# EAGLE design XBee_nRF53240_1_2_may_2022 (EAGLE 9.6.2)
COMPANY: JKSOFT Educational; REV: 1.1; TITLE: RPBee nRF52

## Sheet 1 of 2
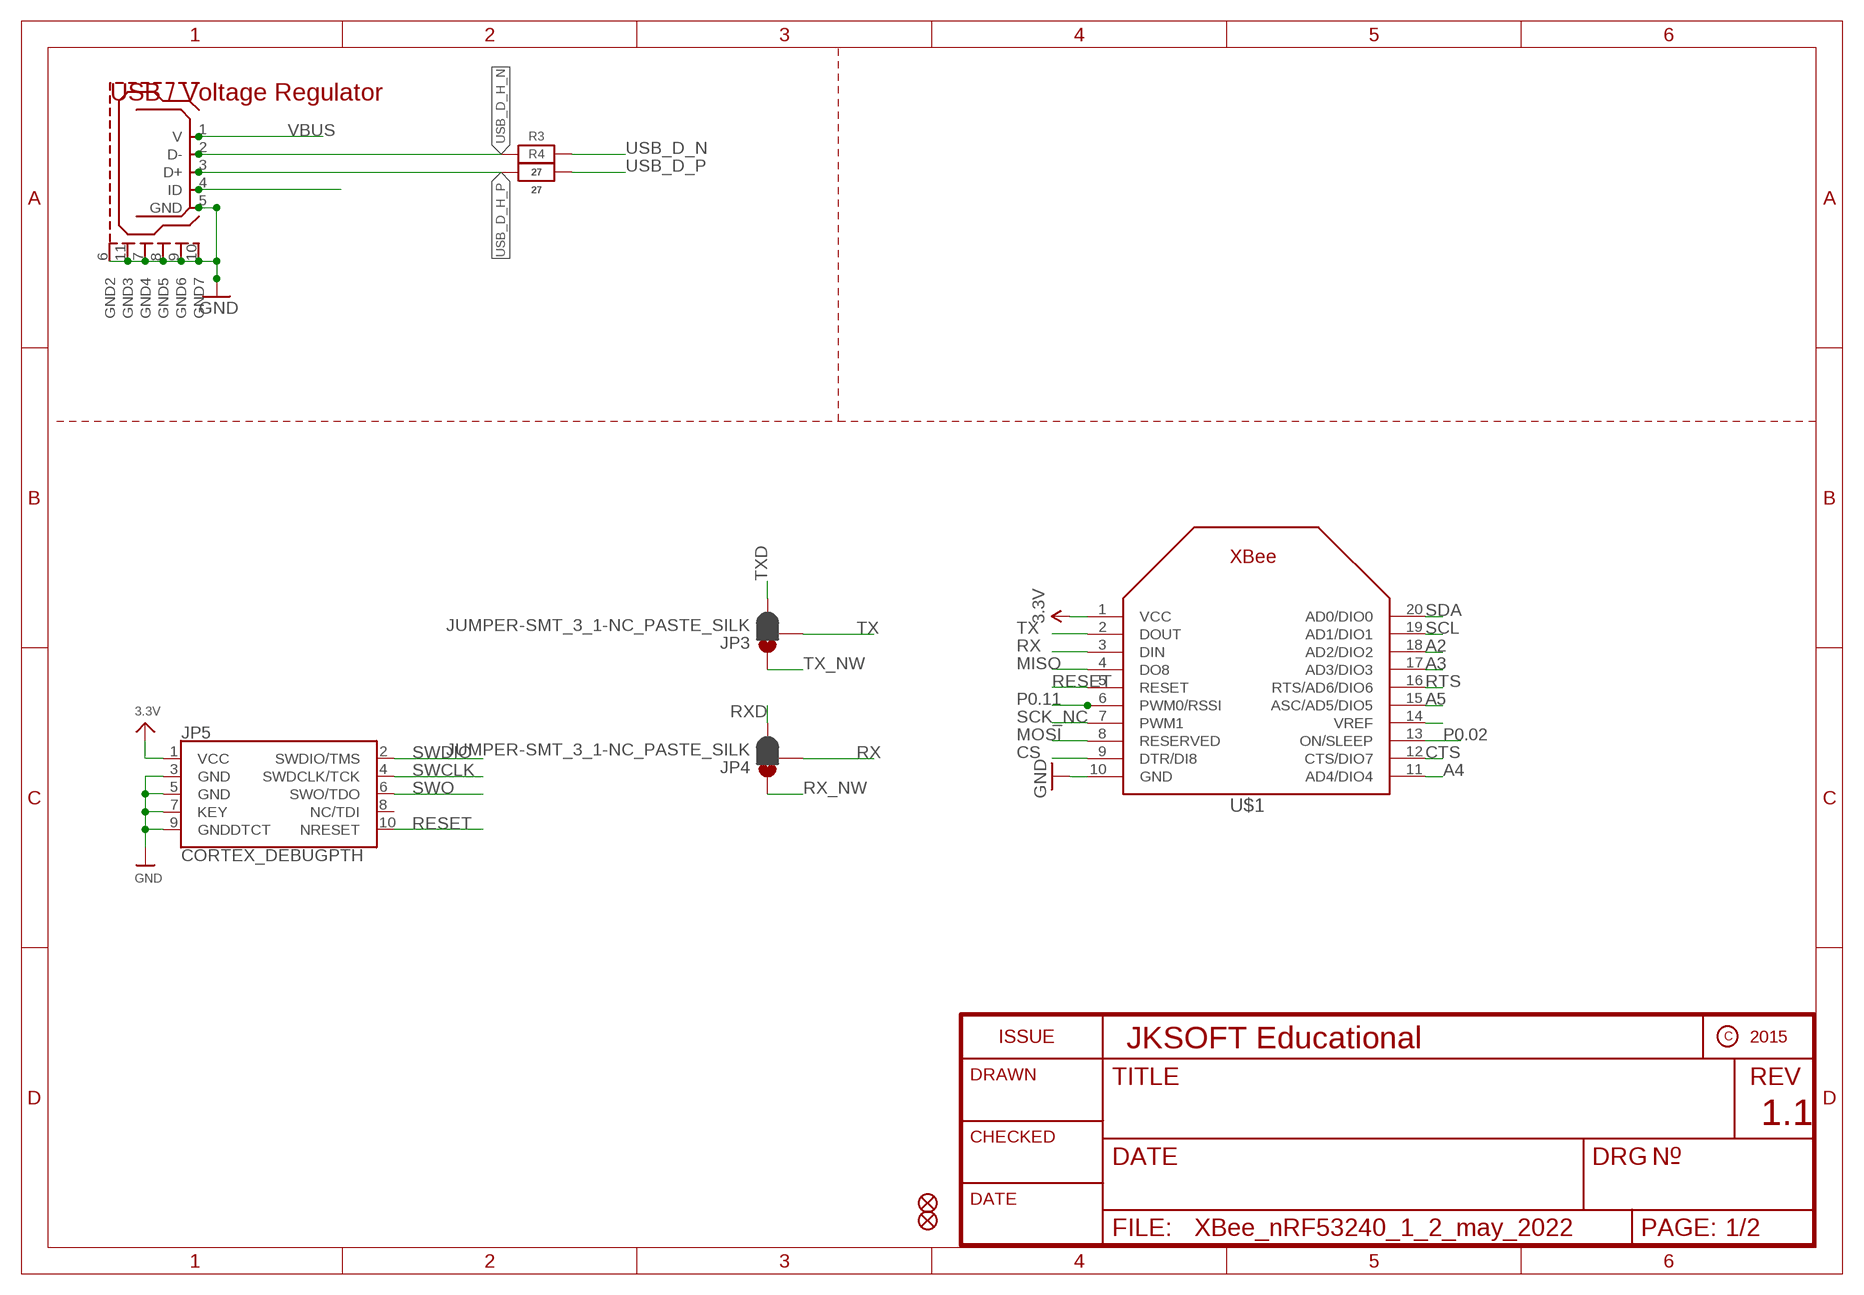
[diagram p0: schematic, sheet 1]

### Parts
FID1  FIDUCIAL_1MM  [FIDUCIAL_1MM]
FID3  FIDUCIAL_1MM  [FIDUCIAL_1MM]
JP3  JUMPER-SMT_3_1-NC_PASTE_SILK  [SMT-JUMPER_3_1-NC_PASTE_SILK]
JP4  JUMPER-SMT_3_1-NC_PASTE_SILK  [SMT-JUMPER_3_1-NC_PASTE_SILK]
JP5  CORTEX_DEBUGPTH  [2X5-PTH-1.27MM]
R3  27  RESISTOR_0603_NOOUT  [0603-NO]
R4  27  RESISTOR_0603_NOOUT  [0603-NO]
U$1  XBEE  [XBEE]
U$2  USB_MICROB  [USB_MICROB_PACKAGE]

### Nets
3.3V [power]: JP5.1(VCC) U$1.1(VCC) ; also sheet 2
A2: U$1.18(AD2/DIO2)
A3: U$1.17(AD3/DIO3)
A4: U$1.11(AD4/DIO4)
A5: U$1.15(ASC/AD5/DIO5)
CS: U$1.9(DTR/DI8)
CTS: U$1.12(CTS/DIO7) ; also sheet 2
GND: JP5.3(GND) JP5.5(GND) JP5.7(KEY) JP5.9(GNDDTCT) U$1.10(GND) U$2.5(GND) U$2.6(GND2) U$2.7(GND4) U$2.8(GND5) U$2.9(GND6) U$2.10(GND7) U$2.11(GND3) ; also sheet 2
MISO: U$1.4(DO8)
MOSI: U$1.8(RESERVED)
N$2: U$1.14(VREF)
N$4: U$2.4(ID)
P0.02: U$1.13(ON/SLEEP)
P0.11: U$1.6(PWM0/RSSI)
RESET: JP5.10(NRESET) U$1.5(RESET) ; also sheet 2
RTS: U$1.16(RTS/AD6/DIO6) ; also sheet 2
RX: JP4.2 U$1.3(DIN)
RX_NW: JP4.1 ; also sheet 2
RXD: JP4.3 ; also sheet 2
SCK_NC: U$1.7(PWM1)
SCL: U$1.19(AD1/DIO1) ; also sheet 2
SDA: U$1.20(AD0/DIO0) ; also sheet 2
SWCLK: JP5.4(SWDCLK/TCK) ; also sheet 2
SWDIO: JP5.2(SWDIO/TMS) ; also sheet 2
SWO: JP5.6(SWO/TDO)
TX: JP3.2 U$1.2(DOUT)
TX_NW: JP3.1 ; also sheet 2
TXD: JP3.3 ; also sheet 2
USB_D_H_N: R3.1 U$2.2(D-)
USB_D_H_P: R4.1 U$2.3(D+)
USB_D_N: R3.2 ; also sheet 2
USB_D_P: R4.2 ; also sheet 2
VBUS: U$2.1(V) ; also sheet 2
Unconnected: JP5.8(NC/TDI)

### Notes on the sheet
- USB / Voltage Regulator

## Sheet 2 of 2
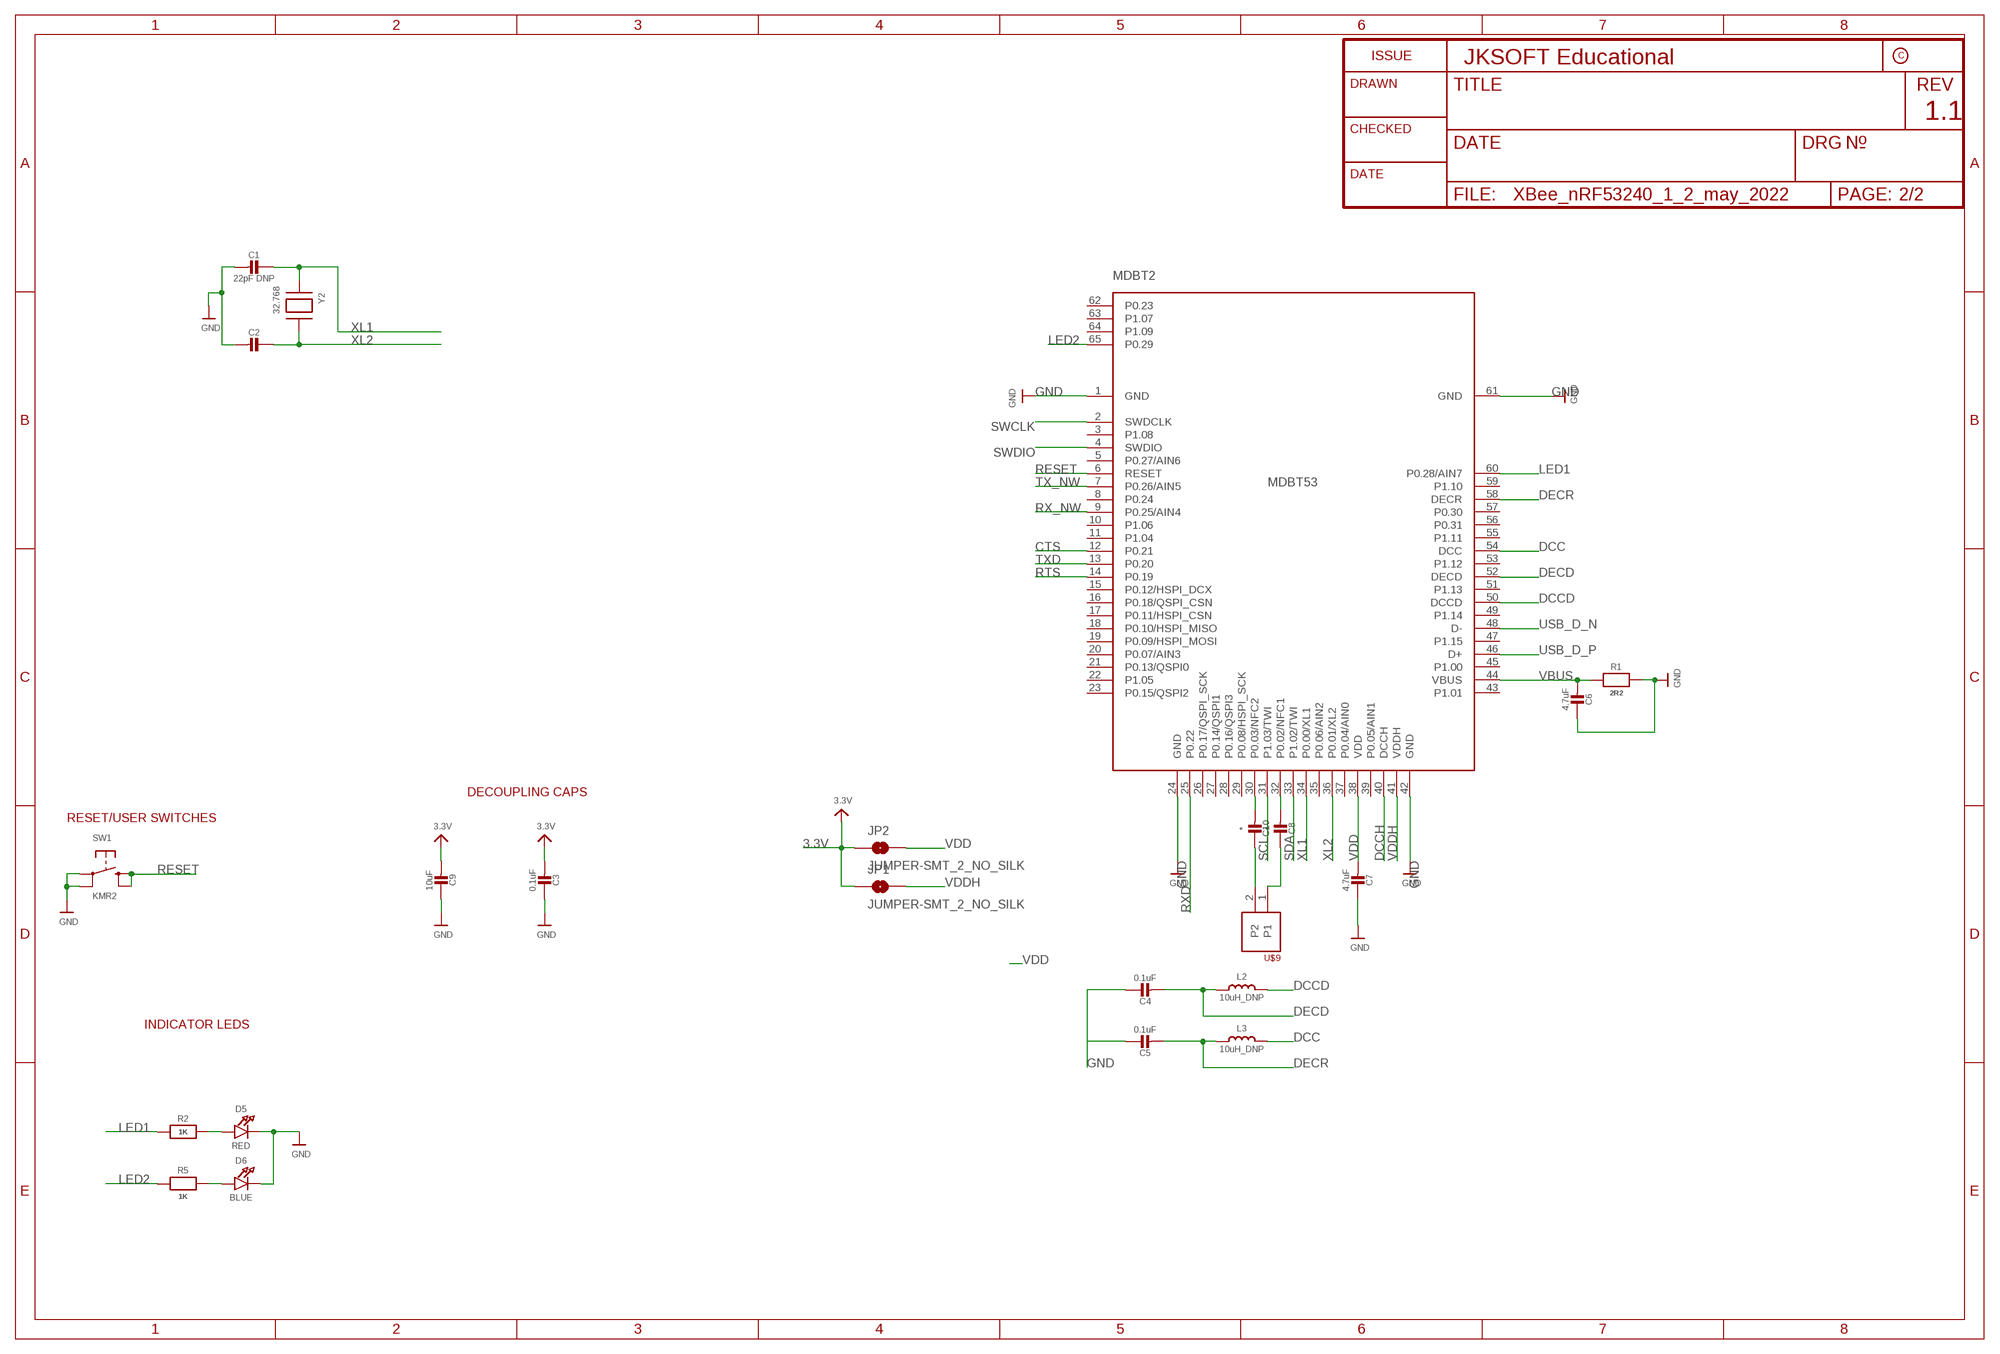
[diagram p1: schematic, sheet 2]

### Parts
C1  22pF DNP  CAP_CERAMIC0603_NO  [0603-NO]
C2  22pF DNP  CAP_CERAMIC0603_NO  [0603-NO]
C3  0.1uF  CAP_CERAMIC0603_NO  [0603-NO]
C4  0.1uF  CAP_CERAMIC0603_NO  [0603-NO]
C5  0.1uF  CAP_CERAMIC0603_NO  [0603-NO]
C6  4.7uF  CAP_CERAMIC0805-NOOUTLINE  [0805-NO]
C7  4.7uF  CAP_CERAMIC0805-NOOUTLINE  [0805-NO]
C8  *  CAP_CERAMIC0603_NO  [0603-NO]
C9  10uF  CAP_CERAMIC0805-NOOUTLINE  [0805-NO]
C10  *  CAP_CERAMIC0603_NO  [0603-NO]
D5  RED  LED0805_NOOUTLINE  [CHIPLED_0805_NOOUTLINE]
D6  BLUE  LED0805_NOOUTLINE  [CHIPLED_0805_NOOUTLINE]
JP1  JUMPER-SMT_2_NO_SILK  [SMT-JUMPER_2_NO_SILK]
JP2  JUMPER-SMT_2_NO_SILK  [SMT-JUMPER_2_NO_SILK]
L2  10uH_DNP  INDUCTOR_0805MP  [_0805MP]
L3  10uH_DNP  INDUCTOR_0805MP  [_0805MP]
MDBT2  MDBT53  [MDBT53]
R1  2R2  RESISTOR_0603_NOOUT  [0603-NO]
R2  1K  RESISTOR_0603_NOOUT  [0603-NO]
R5  1K  RESISTOR_0603_NOOUT  [0603-NO]
SW1  KMR2  SWITCH_TACT_SMT4.6X2.8  [BTN_KMR2_4.6X2.8]
U$9  PHOENIX_PTSM_M2_TH  [PTSM_M2_THRHOLE]
Y2  32.768  XTAL-3.2X1.5  [XTAL3215]

### Nets
3.3V [power]: C3.2 C9.2 JP1.1 JP2.1 ; also sheet 1
CTS: MDBT2.12(P0.21) ; also sheet 1
DCC: L3.2 MDBT2.54(DCC)
DCCD: L2.2 MDBT2.50(DCCD)
DCCH: MDBT2.40(DCCH)
DECD: C4.2 L2.1 MDBT2.52(DECD)
DECR: C5.2 L3.1 MDBT2.58(DECR)
GND: C1.2 C2.2 C3.1 C4.1 C6.1 C7.1 C9.1 D5.C D6.C MDBT2.1(GND) MDBT2.24(GND) MDBT2.42(GND) MDBT2.61(GND) R1.2 SW1.A'(P1) SW1.A(P) ; also sheet 1
LED1: MDBT2.60(P0.28/AIN7) R2.1
LED2: MDBT2.65(P0.29) R5.1
N$1: C10.2 MDBT2.30(P0.03/NFC2)
N$3: C5.1
N$5: C8.2 MDBT2.32(P0.02/NFC1)
N$6: C10.1 U$9.2
N$7: C8.1 U$9.1
N$8: D6.A R5.2
N$15: D5.A R2.2
RESET: MDBT2.6(RESET) SW1.B'(S1) SW1.B(S) ; also sheet 1
RTS: MDBT2.14(P0.19) ; also sheet 1
RX_NW: MDBT2.9(P0.25/AIN4) ; also sheet 1
RXD: MDBT2.25(P0.22) ; also sheet 1
SCL: MDBT2.31(P1.03/TWI) ; also sheet 1
SDA: MDBT2.33(P1.02/TWI) ; also sheet 1
SWCLK: MDBT2.2(SWDCLK) ; also sheet 1
SWDIO: MDBT2.4(SWDIO) ; also sheet 1
TX_NW: MDBT2.7(P0.26/AIN5) ; also sheet 1
TXD: MDBT2.13(P0.20) ; also sheet 1
USB_D_N: MDBT2.48(D-) ; also sheet 1
USB_D_P: MDBT2.46(D+) ; also sheet 1
VBUS: C6.2 MDBT2.44(VBUS) R1.1 ; also sheet 1
VDD: C7.2 JP2.2 MDBT2.38(VDD)
VDDH: JP1.2 MDBT2.41(VDDH)
XL1: C1.1 MDBT2.34(P0.00/XL1) Y2.P$1
XL2: C2.1 MDBT2.36(P0.01/XL2) Y2.P$2
Unconnected: MDBT2.3(P1.08) MDBT2.5(P0.27/AIN6) MDBT2.8(P0.24) MDBT2.10(P1.06) MDBT2.11(P1.04) MDBT2.15(P0.12/HSPI_DCX) MDBT2.16(P0.18/QSPI_CSN) MDBT2.17(P0.11/HSPI_CSN) MDBT2.18(P0.10/HSPI_MISO) MDBT2.19(P0.09/HSPI_MOSI) MDBT2.20(P0.07/AIN3) MDBT2.21(P0.13/QSPI0) MDBT2.22(P1.05) MDBT2.23(P0.15/QSPI2) MDBT2.26(P0.17/QSPI_SCK) MDBT2.27(P0.14/QSPI1) MDBT2.28(P0.16/QSPI3) MDBT2.29(P0.08/HSPI_SCK) MDBT2.35(P0.06/AIN2) MDBT2.37(P0.04/AIN0) MDBT2.39(P0.05/AIN1) MDBT2.43(P1.01) MDBT2.45(P1.00) MDBT2.47(P1.15) MDBT2.49(P1.14) MDBT2.51(P1.13) MDBT2.53(P1.12) MDBT2.55(P1.11) MDBT2.56(P0.31) MDBT2.57(P0.30) MDBT2.59(P1.10) MDBT2.62(P0.23) MDBT2.63(P1.07) MDBT2.64(P1.09)

### Notes on the sheet
- DECOUPLING CAPS
- RESET/USER SWITCHES
- INDICATOR LEDS

## Library data of the parts
C1-C10 = microbuilder:CAP_CERAMIC: Ceramic Capacitors For new designs, use the packages preceded by an '_' character since they are more reliable: The following footprints should be used on most boards: _0402 - Standard footprint for regular board layouts _0603 - Standard footprint for regular board layouts _0805 - Standard footprint for regular board layouts _1206 - Standard footprint for regular board layouts For extremely tight-pitch boards where space is at a premium, the following 'micro-pitch' footprints can be used (smaller pads, no silkscreen outline, etc.): _0402MP - Micro-pitch footprint for very dense/compact boards _0603MP - Micro-pitch footprint for very dense/compact boards _0805MP - Micro-pitch footprint for very dense/compact boards _1206MP - Micro-pitch footprint for very dense/compact boards
D5 D6 = microbuilder:LED: LED 0603 - 0603 Surface Mount Package 2mA: Green LED - Low Power (3.9mcd, 2ma, 1.7Vf) - Digikey: 475-2709-2-ND Orange LED - Low Power (9.8mcd, 2ma, 1.8Vf) - Digikey: 475-1194-2-ND Red LED - Low Power (5mcd, 2ma, 1.8Vf) - Digikey: 475-1195-2-ND Yellow LED - Low Power (7mcd, 2ma, 1.8Vf) - Digikey: 475-1196-2-ND 5mA: Blue LED - Low Power (17mcd, 5ma, 2.9Vf) - Digikey: LNJ937W8CRACT-ND 0805 - 0805 Surface Mount Package 2mA: Red LED (8.8mcd, 2mA, 1.8Vf, Clear) - Low Power [Digikey: 475-2510-1-ND] Green LED (5mcd, 2mA, 1.8Vf, Clear) - Low Power [Digikey: 475-2730-1-ND] Yellow LED (11.3mcd, 2mA, 1.8Vf, Clear) - Low Power [Digikey: 475-2555-1-ND] 20mA: Red LED (104mcd, 20mA, Diffused) - LS R976 [Digikey: 475-1278-6-ND] Red LED (12mcd, 20mA, 2.0Vf, Clear) - APT2012EC [Digikey: 754-1128-1-ND] Green LED (15mcd, 20mA, 2.2Vf, Clear) - APT2012GC [Digikey: 754-1131-1-ND] Orange LED (160mcd, 20mA, 2.1Vf, Clear) - APT2012SECK [Digikey: 754-1130-1-ND] 1206 - 1206 Surface Mount Package Green LED (26mcd, 20mA, Diffused) - LG N971 [Digikey: 475-1407-6-ND] Red LED (15mcd, 20mA, Diffused) - LH N974 [Digikey: 475-1416-6-ND] Cree - Cree High-Power Surface Mount LEDs XPEBWT-L1-0000-00D50 - White 111lm 350mA 2.9Vf 6200K 110° XTEAWT-00-0000-00000LEE3 - White 114lm 350mA 2.85Vf 5000K 115° Everlight - Everlight 45-21 Series Surface Mount LEDs 45-21/QK2C-B2832AC2CB2/2T - Warm White 2000mcd 20mA 3.25Vf 3050K 120° 45-21/LK2C-B38452C4CB2/2T - Nuetral White 2000mcd 20mA 3.25Vf 4150K 120° 45-21/LK2C-B50634C6CB2/2T - Cold White 2200mcd 20mA 3.25Vf 5650K 120° PLCC2 Reverse Mount LS T77K-J1L2-1-0-2-R18-Z - Red 11.25mcd 2mA 1.8Vf 630nm 120° LO T77K-L1M2-24-Z - Orange 19.6mcd 2mA 1.8Vf 606nm 120° LY T77K-K2M1-26-Z - Yellow 15.7mcd 2mA 1.8Vf 587nm 120°
FID1 FID3 = microbuilder:FIDUCIAL: Fiducial Alignment Points Various fiducial points for machine vision alignment.; BOM: EXCLUDE
JP1 JP2 = SparkFun-Jumpers:JUMPER-SMT_2_NO: Normally open jumper This jumper has two pads in close proximity to each other. Apply solder to close the connection. Round pads are easier to solder for beginners, but are a lot larger. SparkFun Product that uses the round pads: SparkFun EL Sequencer <https://www.sparkfun.com/products/12781>
JP3 JP4 = SparkFun-Jumpers:JUMPER-SMT_3_1-NC_PASTE: Normally closed solder jumper (1 of 2 connections) This jumper has an aperture in the stencil to allow solder paste to bridge one of the two connections. One connection is normally closed (NC), while the other is normally open (NO). Wick off the solder to open the connection. Reapply solder to reclose the connection. Apply solder to the other side instead to change the current path.
JP5 = samd21-temp:CORTEX_DEBUG: Cortex Debug Connector Datasheet <http://infocenter.arm.com/help/topic/com.arm.doc.faqs/attached/13634/cortex_debug_connectors.pdf>
L2 L3 = microbuilder:INDUCTOR: Inductors 0603: 10nH Ceramic Inductor - microwire antenna/RF (Digikey: 712-1434-2-ND) 0805: 560nH Ceramic Inductor - RF (Digikey: 553-1047-1-ND) 270nH Ceramic Inductor - Q = 40@250MHz, +-5%, 1 Ohm DC Resistance (Digikey: 535-10506-2-ND) 1007 (2518 Metric) SMT: 10µH 10% 250mOhm 820mA 1007 Inductor (Digikey: 587-2189-1-ND) 22µH 10% 500mOhm 580mA 1007 Inductor (Digikey: 587-2190-1-ND) 47µH 10% 950mOhm 420mA 1007 Inductor (Digikey: 587-2191-1-ND) 47µH 5% 100mOhm 1A 1008 Inductor (Digikey: 732-1816-1-ND) 5.0x5.0mm (Taiyo Yuden NR5040 Series) 6.8µH 20% 2.3A 64mOhm Inductor (Digikey: 587-2374-2-ND) 5.0x5.0mm (TDK VLC5045 Series) 4.7µH 20% 3.3A 34mOhm Inductor (Digikey: 445-6526-1-ND) 6.8µH 20% 2.7A 46mOhm Inductor (Digikey: 445-6527-1-ND) 6.0x6.0mm (TDK VLC6045 Series) 4.7µH 20% 3.8A 27mOhm Inductor (Digikey: 445-6538-2-ND) 6.8µH 20% 3A 41mOhm Inductor (Digikey: 445-6540-1-ND) 6.2µH 30% 2.2A 45mOhm Inductor (Digikey: SRR5028-6R2YCT-ND) - Not TDK VLC6045 but footprint should match 6.0x6.0mm (TDK SLF6045 Series) 6.8uH 30% 2A 33mOhm Inductor (Digikey: 445-4572-1-ND, Mouser: 810-SLF645T6R8N2R0PF) 6.0x6.0mm (Sumida CDRH5D28 Series) 6.2uH 30% 1.8A 45mOhm Inductor (Digikey: 308-1542-1-ND) Taiyo Yuden NR3015T2R2M - 2.2uH 20% 1.5A (Digikey: 587-1648-2-ND, Mouser: 963-NR3015T2R2M) - Used with TI TPS62172 CoilCraft RFID Transponder Coil - MA5532-AE (For use with AS3935 Lightning Sensor) Taiyo Yuden NRH2412T2R2MNGH - 2.2uH 20% 1AA (Digikey: 587-3443-1-ND) - Used with TI LM3671 Vishay IHLP 1.0uH Molded Inductor - 24mOhm DCR, 5A, +/-20%, -55°C-125°C (Digikey: 541-1319-1-ND)
MDBT2 = MDBT53_210707:MDBT53: Raytac Corporation Part Number: MDBT53-1M / MDBT53-P1M / MDBT53-U1M Bluetooth Low Energy Module based on Noridc nRF5340 Size: 14.3x9.3mm Source: Raytac datasheet
R1-R5 = microbuilder:RESISTOR: Resistors For new designs, use the packages preceded by an '_' character since they are more reliable: The following footprints should be used on most boards: _0402 - Standard footprint for regular board layouts _0603 - Standard footprint for regular board layouts _0805 - Standard footprint for regular board layouts _1206 - Standard footprint for regular board layouts For extremely tight-pitch boards where space is at a premium, the following 'micro-pitch' footprints can be used (smaller pads, no silkscreen outline, etc.): _0402MP - Micro-pitch footprint for very dense/compact boards _0603MP - Micro-pitch footprint for very dense/compact boards _0805MP - Micro-pitch footprint for very dense/compact boards _1206MP - Micro-pitch footprint for very dense/compact boards
SW1 = microbuilder:SWITCH_TACT_SMT: SMT Tact Switches 6x6mm - Digikey: P12940SCT-ND KMR2 (4.6x2.8mm) - Digikey: 401-1426-1-ND EVQ-PQHB55 - Light Touch, 160GF (4.5x4.5mm) - Digikey: P8090SCT-ND KMT0 - KMT021 NGJ LHS (etc.) IP68/Waterproof - Digikey: CKN10289CT-ND
U$1 = adafruit:XBEE
U$2 = femtoduino:USB_MICROB: This is the hirose ZX62-B-5PA(11) MICRO-USB B Type female connection.
U$9 = jk_customs:PHOENIX_PTSM_M2_TH
Y2 = adafruit2:XTAL: Low cost SMT crystals, no capacitors included http://www.ladyada.net/library/eagle

## Net classes
1 power: width 0.254 mm

## Board
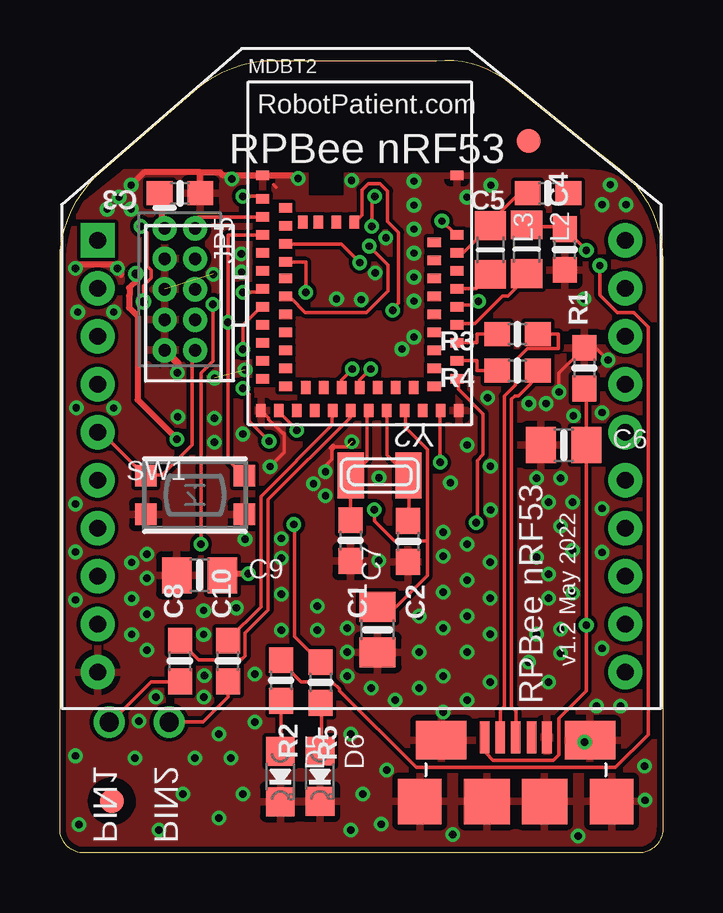
[diagram p2: board, top side]
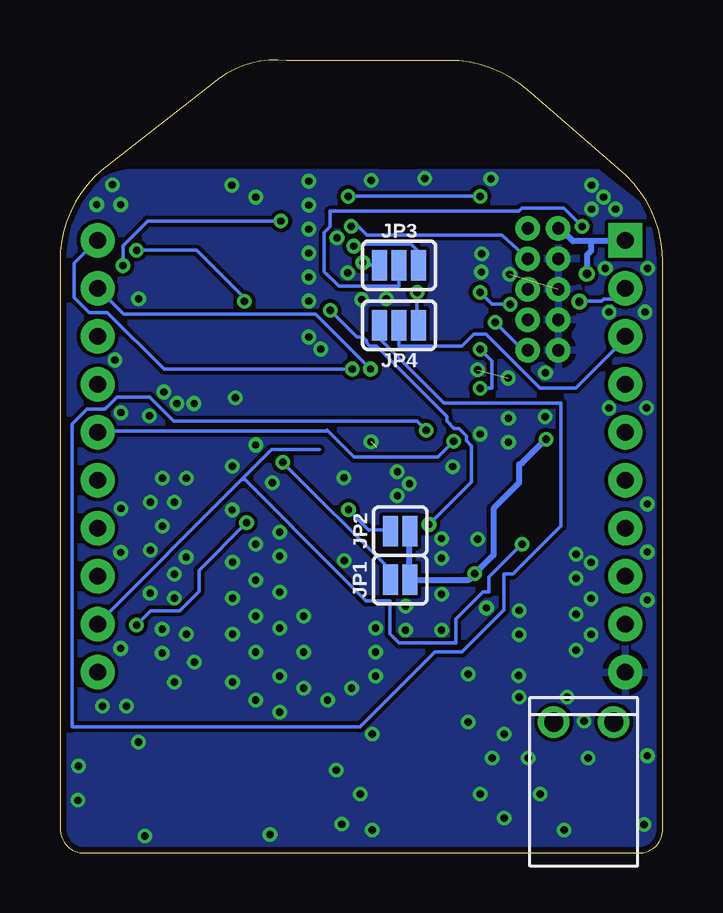
[diagram p3: board, bottom side, seen from below]

Size 25.14 x 33.06 mm. Coordinates in mm from the lower left corner, seen from the top.
Outline: 1.85,28.53 5.65,31.82 arc-41 8.93,33.04 15.69,33.04 arc-41 18.47,32.31 23.42,28.45 arc-49 25.14,24.67 25.14,7.09 25.13,1 arc-90 24.13,0 1,0 arc-90 0,1 0,24.64 arc-51 1.85,28.53
Copper layers (1*16): Top 0.035mm / dielectric 1.5mm / Bottom 0.035mm
Design rules "SeeedStudio_2layer_DRU_no_angle_20140221": minimum track width 6mil, minimum drill 12mil, track to track 6mil, track to pad 6mil, pad to pad 6mil, via to via 6mil, smd to smd 0mil, copper to edge 10mil, drill to drill 10mil, minimum pad ring 10mil, minimum via ring 6mil, stop-mask expansion 2mil, vias tented up to drill 100mil, thermal gap 10mil

### Footprints (pad centres in the part's own frame; a part is rotated, then mirrored left to right if it is on the bottom)
0603-NO = smd 1.075 x 1: 1 -0.85,0; 2 0.85,0
0805-NO = smd 1.24 x 1.5: 1 -0.95,0; 2 0.95,0
CHIPLED_0805_NOOUTLINE = smd 1.2 x 1.2: A 0,-1.05; C 0,1.05
FIDUCIAL_1MM = smd 1 x 1: 1 0,0
SMT-JUMPER_2_NO_SILK = smd 0.635 x 1.27: 1 -0.406,0; 2 0.406,0
SMT-JUMPER_3_1-NC_PASTE_SILK = smd 0.635 x 1.27: 1 -0.813,0; 2 0,0; 3 0.813,0
2X5-PTH-1.27MM = drill 0.508 pad 1: 1 -2.54,-0.635; 2 -2.54,0.635; 3 -1.27,-0.635; 4 -1.27,0.635; 5 0,-0.635; 6 0,0.635; 7 1.27,-0.635; 8 1.27,0.635; 9 2.54,-0.635; 10 2.54,0.635
_0805MP = smd 1.2 x 1.3: 1 -1.016,0; 2 1.016,0
MDBT53 = smd 0.55 x 0.4: 1 -4.05,3.25; 2 -4.05,2.275; 3 -3.1,1.9; 4 -4.05,1.525; 5 -3.1,1.15; 6 -4.05,0.775; 7 -3.1,0.4; 8 -4.05,0.025; 9 -3.1,-0.35; 10 -4.05,-0.725; 11 -3.1,-1.05; 12 -4.05,-1.475; 13 -3.1,-1.8; 14 -4.05,-2.225; 15 -3.1,-2.55; 16 -4.05,-2.975; 17 -3.1,-3.3; 18 -4.05,-3.725; 19 -3.1,-4.05; 20 -4.05,-4.475; 21 -3.1,-4.8; 22 -4.05,-5.225; 23 -3.1,-5.55; 43 3.1,-5.55; 44 4.05,-5.225; 45 3.1,-4.8; 46 4.05,-4.475; 47 3.1,-4.05; 48 4.05,-3.725; 49 3.1,-3.3; 50 4.05,-2.975; 51 3.1,-2.55; 52 4.05,-2.225; 53 3.1,-1.8; 54 4.05,-1.475; 55 3.1,-1.05; 56 4.05,-0.725; 57 3.1,-0.3; 58 4.05,0.025; 59 3.1,0.45; 60 4.05,0.775; 61 4.05,3.25 | smd 0.4 x 0.55: 24 -4.125,-6.55; 25 -3.375,-6.55; 26 -2.625,-6.55; 27 -2.25,-5.6; 28 -1.875,-6.55; 29 -1.5,-5.6; 30 -1.125,-6.55; 31 -0.75,-5.6; 32 -0.375,-6.55; 33 0,-5.6; 34 0.375,-6.55; 35 0.75,-5.6; 36 1.125,-6.55; 37 1.5,-5.6; 38 1.875,-6.55; 39 2.25,-5.6; 40 2.625,-6.55; 41 3.375,-6.55; 42 4.125,-6.55; 62 -2.375,1.3; 63 -1.725,1.3; 64 -0.975,1.3; 65 -0.225,1.3
BTN_KMR2_4.6X2.8 = smd 0.9 x 0.9: A 2.05,0.8; A' -2.05,0.8; B 2.05,-0.8; B' -2.05,-0.8
XBEE = drill 0.7 pad 1.422 square: 1 -11,5.5 | drill 0.7 pad 1.422: 2 -11,3.5; 3 -11,1.5; 4 -11,-0.5; 5 -11,-2.5; 6 -11,-4.5; 7 -11,-6.5; 8 -11,-8.5; 9 -11,-10.5; 10 -11,-12.5; 11 11,-12.5; 12 11,-10.5; 13 11,-8.5; 14 11,-6.5; 15 11,-4.5; 16 11,-2.5; 17 11,-0.5; 18 11,1.5; 19 11,3.5; 20 11,5.5
USB_MICROB_PACKAGE = smd 0.4 x 1.35: 1 -1.3,-0.68; 2 -0.64,-0.68; 3 0,-0.68; 4 0.66,-0.68; 5 1.3,-0.68 | smd 2.1 x 1.6: 6 -3.1,-0.8; 11 3.1,-0.8 | smd 1.8 x 1.9: 7 -4,-3.35; 10 4,-3.35 | smd 1.9 x 1.9: 8 -1.2,-3.35; 9 1.2,-3.35
PTSM_M2_THRHOLE = drill 0.8: 1 1,1; 2 3.5,1
XTAL3215 = smd 1.1 x 1.9: P$1 1.2,0; P$2 -1.2,0

### Placement (x,y rotation side)
C1  12.11,13.02 270 top
C2  14.52,12.99 270 top
C3  5,27.5 180 top
C4  21.05,25.16 90 top
C5  20.35,27.51 180 top
C6  21,17 0 top
C7  13.24,9.31 90 top
C8  5,8 90 top
C9  5.82,11.58 0 top
C10  7,8 90 top
D5  9.19,3.19 180 top
D6  10.84,3.2 180 top
FID1  19.54,29.69 0 top
FID3  2.16,2.16 0 top
JP1  10.95,11.39 180 bottom
JP2  10.95,13.42 180 bottom
JP3  11,24.5 0 bottom
JP4  11,22 180 bottom
JP5  5,23.5 270 top
L2  19.46,25.17 270 top
L3  17.95,25.14 270 top
MDBT2  12.5,25 0 top
R1  21.87,20.21 90 top
R2  9.22,7.19 270 top
R3  19.08,21.64 180 top
R4  19.08,20.11 180 top
R5  10.86,7.11 270 top
SW1  5.63,14.92 180 top
U$1  12.57,20.04 0 top
U$2  19,5.5 0 top
U$9  1.05,6.46 180 bottom
Y2  13.33,15.74 180 top

### Tracks (layer width: path | path; a pad name or v marks a point on that pad's centre or on a via)
3.3V  (via drill 0.3, 0.35)
  Top 0.254: v7.85,11.64 6.78,11.64 C9.2 | 4.19,27.49 C3.2 4.25,27.5 4.25,26.12 JP5.1 | 3.16,24.14 v3.17,24.14 3.17,23.85 2.91,23.59 | 2.91,23.59 2.88,23.56 | 2.91,23.59 2.91,23.27 2.88,23.23 2.88,22.73 3.23,22.38 3.23,18.89 v4.88,17.25
  Bottom 0.254: JP2.1 10.59,13.39 10.59,11.4 JP1.1 8.1,11.39 v7.85,11.64 7.06,12.42 7.06,14.36 6,15.43 6,16.2 5.88,16.25 v4.88,17.25 | 3,25.5 1.62,25.5 U$1.1 | 3,25.5 3.75,25.5 4.25,26 JP5.1 | 3,25.5 3,25.1 3.17,24.93 v3.17,24.14
CTS  (via drill 0.3)
  Top 0.152: 8.38,23.45 MDBT2.12 8.38,23.38 v7.62,23.38 | v6.38,22.88 6.38,20.5 5.88,20 v5.88,12.88
  Bottom 0.152: 14.33,16.82 16.31,16.82 17.56,15.56 | 17.75,15.38 23.55,9.58 U$1.12 | 17.75,15.38 17.56,15.56 | v7.62,23.38 7.12,22.88 v6.38,22.88 | v5.88,12.88 7.25,11.5 7.25,10.88 7.5,10.88 8.62,9.75 8.62,8.75 11,8.75 11.38,9.12 11.38,10.5 12.38,10.5 15.45,13.57 15.45,13.59 17.42,15.56 17.56,15.56 | 17.75,15.38
DCC
  Top 0.152: MDBT2.54 16.61,23.53 17.37,23.53 17.91,24.06 L3.2
DCCD
  Top 0.152: MDBT2.50 16.61,22.08 17.3,22.08 18.44,23.22 18.67,23.22 19.43,23.98 19.43,24.14 L2.2
DECD  (via drill 0.3)
  Top 0.152: v17.45,22.99 17.3,22.84 16.61,22.84 MDBT2.52 | v21.95,25.13 21.11,25.96 C4.2 21.03,26.04 20.95,26.12 19.51,26.12 L2.1
  Bottom 0.152: v17.45,22.99 17.45,23.13 19.45,25.13 v21.95,25.13
DECR
  Top 0.152: MDBT2.58 16.61,25.05 16.84,25.05 17.91,26.12 L3.1 17.98,26.19 17.98,26.34 19.13,27.49 19.43,27.49 C5.2
GND  (via drill 0.3)  (3 unrouted)
  Top 0.152: 8.91,27.87 9.02,27.77 | v22.85,20.55 22.34,21.06 R1.2 20.81,20 v20.81,19.22 | 11.94,16.92 11.39,16.92 | 11.35,16.88 11.35,16.42 11,16.07 | MDBT2.24 8.7,18.13 8.7,18.08 9.28,17.5 9.34,17.5 9.34,16.69 v8.76,16.11
  Top 0.254: C3.1 5.85,28.38 | 5.85,28.38 3.51,28.38 v2.97,27.84 | 5.85,28.38 6.65,28.38 6.77,28.26 7.01,28.26 v7.17,28.1 | v0.64,24.38 0.81,24.55 2.4,24.55 2.42,24.57 2.46,24.57 2.55,24.48 2.55,24.11 | v9.93,28.12 9.8,28.25 MDBT2.1 7.32,28.25
  Top 0.275: 11.39,16.92 11.35,16.88
  Top 0.305: v4.9,20.02 4.9,20.43 JP5.9
  other vias: 16.97,27.34 17.97,27.84 1.97,26.84 2.97,26.84 2.47,27.34 13.3,15.65 16.98,12.87 15.98,12.37 15.98,10.87 15.98,9.37 16.98,11.37 16.98,9.87 14.98,9.87 14.98,8.37 15.98,7.37 16.98,8.37 16.98,6.37 14.98,6.87 13.98,6.37 5.99,10.11 8.12,7.46 8.12,5.46 6.62,4.96 7.12,3.96 12.12,4.96 13.62,3.46 12.62,2.46 3.12,3.96 3.62,8.46 3.62,9.96 3.62,11.46 0.65,14.55 0.65,12.55 0.65,10.55 0.65,4.05 24.37,3.63 21.87,4.63 22.37,6.13 23.37,6.13 20.37,7.13 19.87,9.13 20.37,10.63 20.37,14.63 20.87,13.63 20.87,15.63 20.27,18.74 17.83,18.98 20.88,8.33 22.61,8.53 22.61,12.53 22.61,27.03 23.61,27.03 22.95,27.86 6.45,19.8 7.72,20.14 7.57,24.22 9.23,13.11 9.23,12.29 9.23,10.79 9.23,9.29 10.73,9.29 10.73,10.29 21.86,23.1 22.6,18.36 22.6,14.36 20.88,9.33 19.88,12.33 21.38,10.83 17.94,7.12 17.94,9.12 17.94,10.62 17.94,12.12 17.95,16.13 17.96,14.3 19.87,15.63 19.54,7.96 15.98,5.87 21.6,0.71 16.38,0.77 24.39,2.2 13.39,1.2 7.62,2.46 5.12,2.46 6.62,1.46 5.62,3.96 12.12,0.96 4.12,0.96 4,6.5 6.02,7.39 7.36,10.22 21.37,14.63 21.37,12.63 20.37,11.63 12.98,6.87 11.98,9.37 11.98,8.37 11.98,7.37 13.29,12.19 0.79,1.19 3.29,5.5 6,6.5 3.62,12.46 0.68,18.56 7.72,13.08 5.99,9.11 2.99,9.11 2.99,10.61 2.99,12.11 15.98,13.37 12.17,17.15 4.91,18.18 2.24,22.55 0.74,22.55 2.4,24.37 14.76,28.01 14.76,27.01 14.76,26.01 14.76,25.01 14.76,24.01 14.76,21.51 14.26,21.01 11.07,15.89 11.07,14.89 10.57,15.39 16.28,15.44 16.98,17.01 19.55,18.74 21.41,18.23 7.56,24.98 6.39,24.13 2.24,18.55 6.44,18.13 6.44,17.13 7.62,17.47 14.76,23.01 12.56,23.07 11.53,23.1 13.59,25.64 12.16,28.04 13.14,24.18
  pour Top: 23.83,-5.83 23.83,-5.83 22.5,-4.5 0.5,-4.5 0.05,-4.05 0.05,24.76 arc-54 1.32,27.25 2.71,28.37 10.29,28.37 10.29,27.36 12.01,27.36 11.92,28.36 22.03,28.36 arc-68 24.63,26.59 arc-26 24.82,25.33 24.82,-4.32 24.87,-4.37
  pour Bottom: 24.82,-4 0.05,-4 0.05,24.76 arc-54 1.32,27.25 2.71,28.37 10.28,28.37 10.28,28.34 11.9,28.37 22.01,28.37 arc-68 24.63,26.59 arc-26 24.82,25.33
LED1  (via drill 0.3)
  Top 0.152: v15.93,26.34 16.46,25.81 16.54,25.81 MDBT2.60 | v22.51,24.49 22.51,23.27 23.24,22.54 23.93,22.54 24.54,21.93 24.54,4.93 23.16,3.56 14.86,3.56 11.66,6.76 11.66,6.84 11.35,7.14 10.06,7.14 9.22,7.98 R2.1
  Bottom 0.152: v15.93,26.34 21.49,26.34 22.51,25.32 v22.51,24.49
LED2  (via drill 0.3)
  Top 0.152: 12.34,26.12 12.34,26.27 MDBT2.65 12.38,26.38 12.59,26.59 12.59,27.64 12.87,27.91 13.34,27.91 13.66,27.6 13.66,26.33 14.12,25.87 14.12,22.92 13.88,22.67 v13.88,22.62 | v9.75,13.7 9.77,13.68 9.77,9.03 10.82,7.98 R5.1
  Bottom 0.152: v9.75,13.7 7.97,15.47 7.97,16.98 8.19,17.19 8.19,17.39 8.5,17.7 8.7,17.7 9,18 9,18.19 11.94,21.14 12.22,21.14 12.36,21.27 12.36,21.36 12.5,21.5 12.75,21.5 v13.88,22.62
N$1
  Top 0.152: MDBT2.30 11.35,18.42 11.35,17.84 8.38,14.87 8.38,10.27 7.01,8.9 C10.2
N$5
  Top 0.152: MDBT2.32 12.12,18.42 12.12,18.16 8.69,14.73 8.69,10.14 7.73,9.18 7.73,8.22 7.59,8.08 7.53,8.08 7.5,8.06 5.79,8.06 5.03,8.82 C8.2
N$6
  Top 0.152: C10.1 7,6.5 5.96,5.46 U$9.2
N$7
  Top 0.152: C8.1 4.95,7.14 3.81,7.14 2.16,5.5 2.08,5.5 U$9.1
N$8
  Top 0.152: R5.2 10.9,6.23 10.9,4.32 D6.A
N$15
  Top 0.152: R2.2 9.22,6.3 9.22,4.25 D5.A
RESET  (via drill 0.3)
  Top 0.152: MDBT2.6 8.38,25.75 7,25.75 v7,22.12 7,16.38 7.62,15.75 SW1.B' | U$1.5 1.62,17.62 3.5,15.75 SW1.B 3.62,15.75 4.25,15.75 5.5,17 5.5,20.75 5.62,20.88 JP5.10
  Bottom 0.152: v7,22.12 5.88,21 5.75,21 JP5.10
RTS  (via drill 0.3)
  Top 0.152: 8.38,22.76 MDBT2.14 8.38,22.75 7.62,22 v7.62,21 | v7.62,19.38 7.88,19.12 7.88,18.02 v8.72,17.17
  Bottom 0.152: U$1.16 23.55,17.58 14.02,17.58 14,17.62 12.88,16.5 9.39,16.5 v8.72,17.17 | v7.62,21 7.12,20.5 7.12,19.38 v7.62,19.38
RX
  Bottom 0.152: JP4.2 11,21.12 8.38,21.12 7.88,21.62 7.38,21.62 5.12,19.38 3.62,19.38 1.5,21.5 U$1.3
RX_NW  (via drill 0.3)
  Top 0.152: v10.25,23.38 10.25,24.62 9.5,24.62 MDBT2.9
  Bottom 0.152: v10.25,23.38 10.25,22 JP4.1
RXD  (via drill 0.3)
  Top 0.152: v9.88,17.62 9.12,18.38 MDBT2.25
  Bottom 0.152: v9.88,17.62 10.25,18 20.39,18 21.39,19 22.75,19 23.25,18.5 24,18.5 24.62,17.88 24.62,5.25 12.62,5.25 9.5,8.38 8.38,8.38 6.62,10.12 6.62,11.62 6.25,11.62 4.25,13.62 4.25,18.75 9.12,18.75 11.75,21.38 11.75,22 JP4.3
SCL  (via drill 0.3)
  Top 0.152: v12.19,20.17 11.73,19.72 11.73,19.41 MDBT2.31
  Bottom 0.152: v12.19,20.17 14.48,22.46 22.48,22.46 23.55,23.53 U$1.19
SDA  (via drill 0.3)
  Top 0.152: v12.95,20.17 12.5,19.72 12.5,19.41 MDBT2.33
  Bottom 0.152: v12.95,20.17 20.8,20.17 23.16,22.54 23.93,22.54 24.54,23.14 24.54,24.59 23.62,25.51 U$1.20
SWCLK  (via drill 0.3)
  Top 0.152: v7.62,27.38 8.38,27.38 MDBT2.2 | v13.12,27.38 13,27.25 v13,26.12
  Bottom 0.152: v13.12,27.38 v7.62,27.38 | v13,26.12 12.72,26.12 12.35,25.75 6.71,25.75 | 6.71,25.75 | 6.71,25.75 JP5.4
SWDIO
  Top 0.152: 8.38,26.5 MDBT2.4 8.38,26.5 5.75,26.5 5.75,26.12 JP5.2
TX  (via drill 0.3, 0.35)
  Top 0.152: v3.38,26.12 3.63,25.87 3.63,24.46 3.8,24.3 3.8,23.97 3.48,23.66 v3.48,22.98
  Bottom 0.152: JP3.2 11,23.64 13.51,23.64 14.12,24.25 14.12,25.86 13.88,26.1 13.88,26.75 6,26.75 5.88,26.88 4.12,26.88 v3.38,26.12 | U$1.2 2.03,23.08 2.46,23.08 2.54,23 3.5,23 v3.48,22.98
TX_NW  (via drill 0.3)
  Top 0.152: v12.51,24.61 11.74,25.38 9.5,25.38 MDBT2.7
  Bottom 0.152: v12.51,24.61 12.39,24.5 JP3.1
TXD  (via drill 0.3)
  Top 0.152: v12.89,25.3 13.68,24.52 13.68,23.43 12.79,22.54 10.21,22.54 9.62,23.12 9.5,23.12 MDBT2.13
  Bottom 0.152: v12.89,25.3 12.57,25.3 12.5,25.38 10.5,25.38 10.25,25.12 10.25,24.5 JP3.3
USB_D_H_N
  Top 0.152: R3.1 20.77,21.64 20.77,21.03 19.49,21.03 19,20.54 19,19.52 18.53,19.05 18.53,6.11 18.36,5.94 U$2.2
USB_D_H_P
  Top 0.152: U$2.3 19,5.92 18.83,6.09 18.83,18.92 18.97,19.06 19.11,19.06 20.16,20.11 | R4.1 20.16,20.11 | 20.16,20.11
USB_D_N
  Top 0.152: R3.2 17.39,21.64 17.39,21.27 MDBT2.48
USB_D_P
  Top 0.152: R4.2 17.39,20.11 17.39,20.52 MDBT2.46
VBUS  (via drill 0.3)
  Top 0.152: R1.1 21.95,19.34 21.95,17.05 C6.2 21.95,16.97 v21.95,9.5 21.95,6.76 20.8,5.62 20.8,4.09 20.57,3.87 18.06,3.87 17.75,4.17 17.75,4.78 U$2.1 | MDBT2.44 16.61,19.72 16.61,19.34 17.64,18.31 17.64,16.61 17.4,16.37 17.4,13.81 v17.36,13.77
  Bottom 0.152: v17.36,13.77 19.35,11.78 19.35,10.9 20.15,10.1 21.35,10.1 v21.95,9.5
VDD  (via drill 0.3)
  Top 0.152: 15.32,13.01 15.32,11.56 14.02,10.27 13.26,10.27 C7.2 | 15.32,13.01 15.32,16.82 14.4,17.73 14.4,18.42 MDBT2.38 | v13.11,14.31 13.11,13.85 13.95,13.01 15.32,13.01
  Bottom 0.152: v13.11,14.31 12.27,13.47 11.43,13.47 JP2.2
VDDH  (via drill 0.3)
  Top 0.152: v15.85,16.29 15.85,18.42 MDBT2.41
  Bottom 0.152: v15.85,16.29 11.42,11.86 JP1.2
XL1
  Top 0.152: MDBT2.34 12.8,18.42 12.8,16.36 12.19,15.75 Y2.P$1 12.12,15.68 12.12,13.93 C1.1
XL2
  Top 0.152: MDBT2.36 13.64,18.42 13.64,16.59 14.48,15.75 Y2.P$2 14.55,15.68 14.55,13.85 C2.1

### Text on the board
_tsilk: RobotPatient.com
_bsilk: RobotPatient.com | RobotPatient.com